# Altium schematic sheet 11-SoC POWER1.SchDoc
size 513 x 386 mm
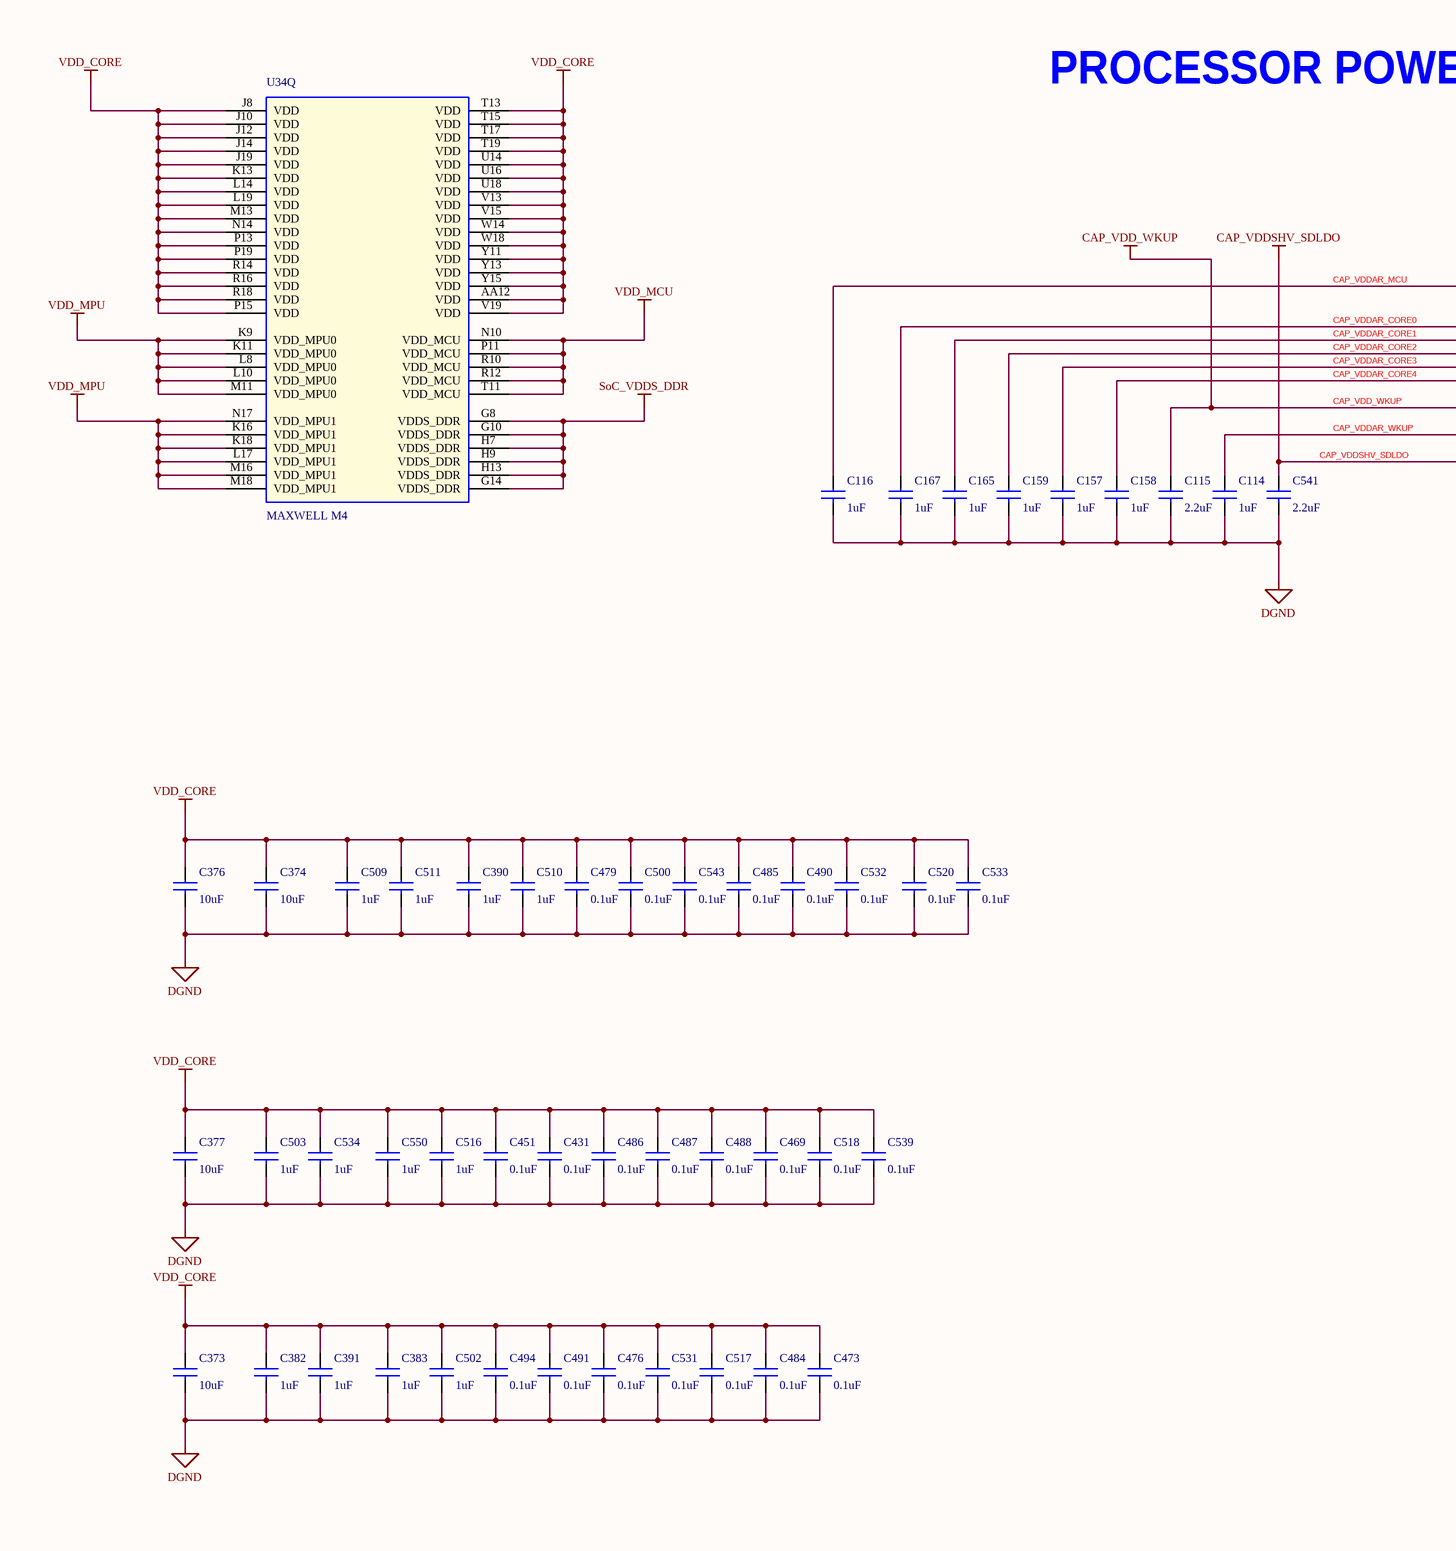
[diagram p0: 11-SoC POWER1.SchDoc, left]
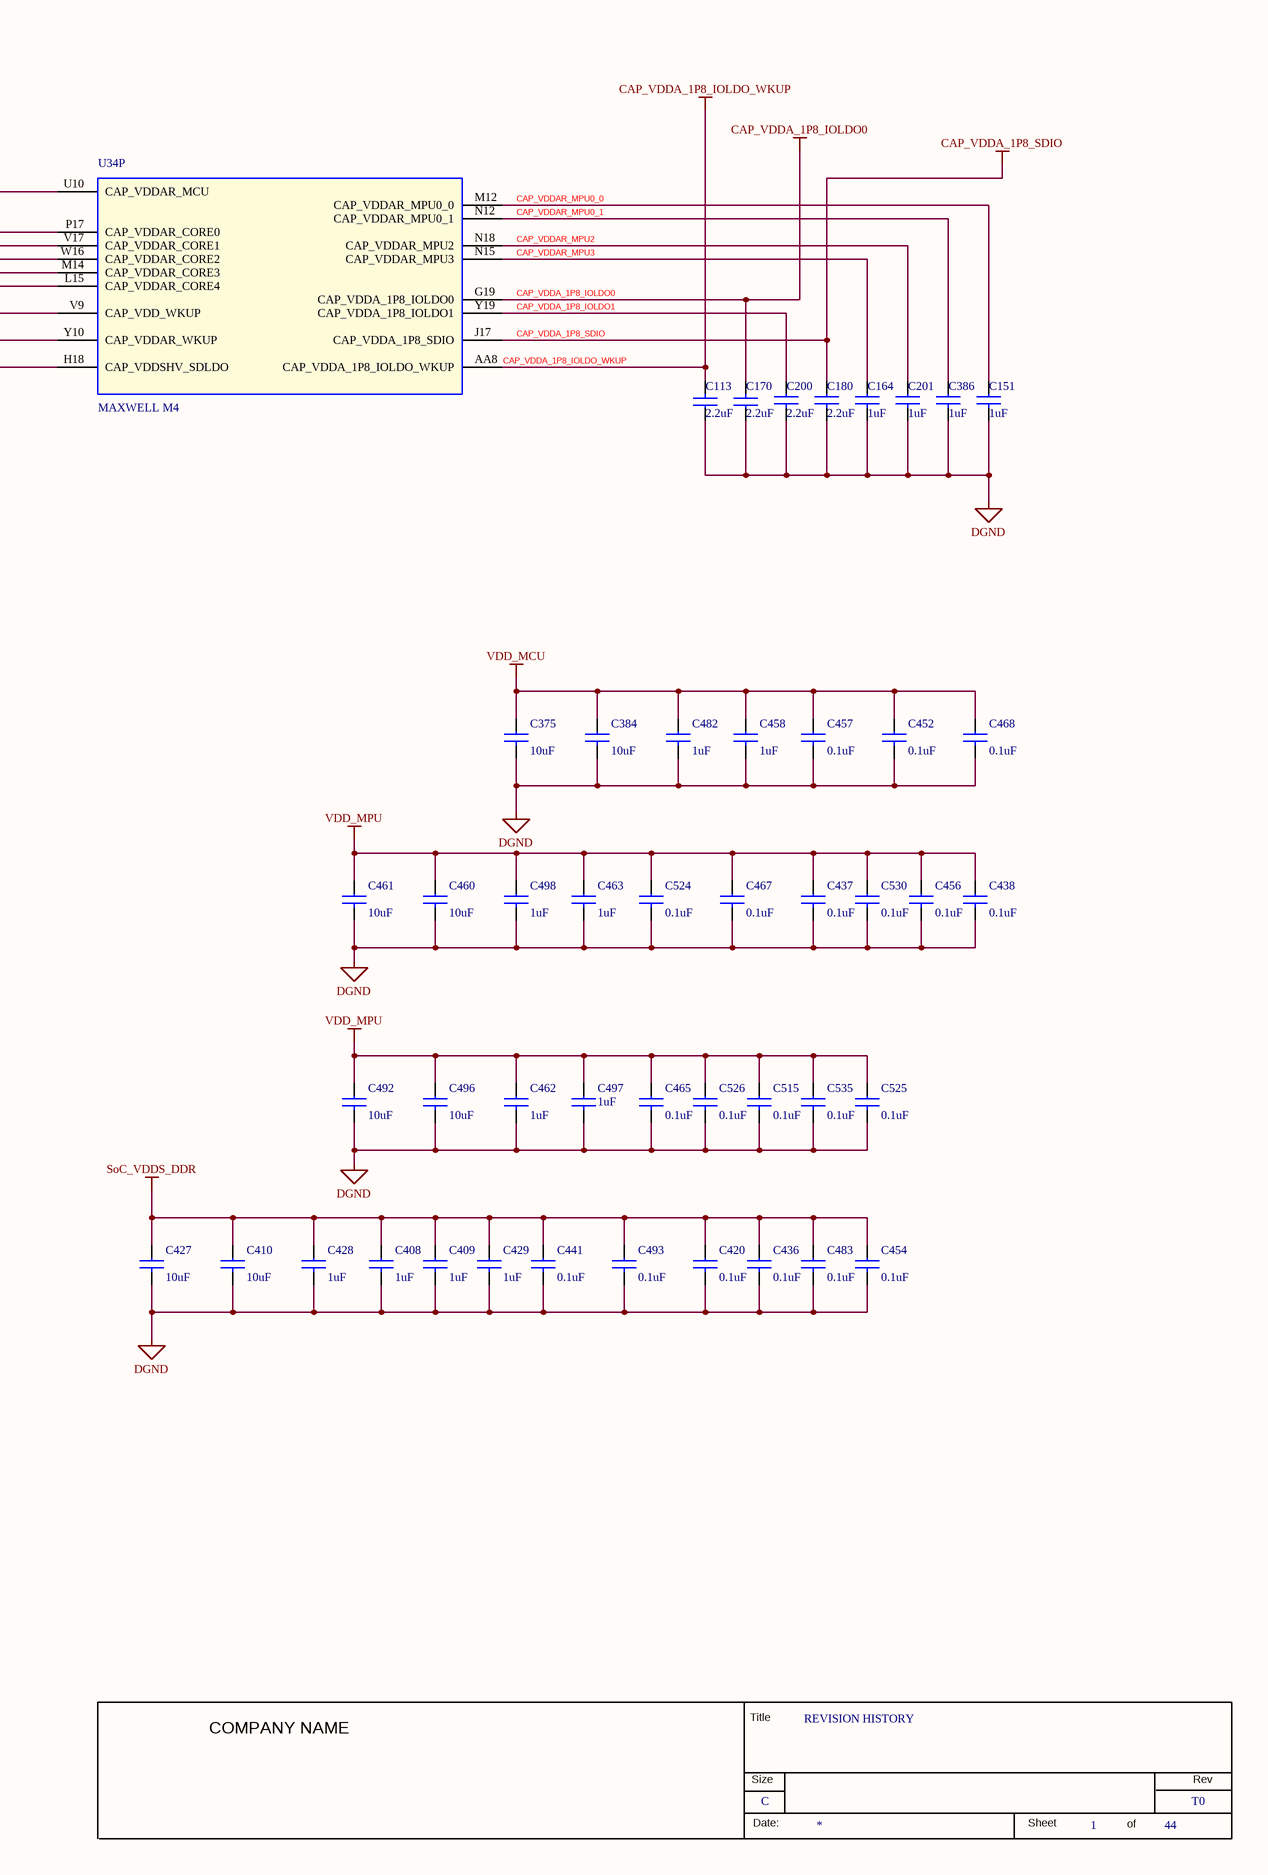
[diagram p1: 11-SoC POWER1.SchDoc, right]

## Parts
*  RevCode: T0  Title: REVISION HISTORY  Page Size: C  Page Number: 1  Page Count: 44  (hidden comment: TRAINING_TITLEBLK_CSIZE)  (graphical)
C113  2.2uF  [CAP0603]
C114  1uF  [CAP0402_0-75]
C115  2.2uF  [CAP0402_0-75]
C116  1uF  [CAP0402_0-75]
C151  1uF  [CAP0402_0-75]
C157  1uF  [CAP0402_0-75]
C158  1uF  [CAP0402_0-75]
C159  1uF  [CAP0402_0-75]
C164  1uF  [CAP0402_0-75]
C165  1uF  [CAP0402_0-75]
C167  1uF  [CAP0402_0-75]
C170  2.2uF  [CAP0603]
C180  2.2uF  [CAP0402_0-75]
C200  2.2uF  [CAP0402_0-75]
C201  1uF  [CAP0402_0-75]
C373  10uF  [CAP0603_1]
C374  10uF  [CAP0603_1]
C375  10uF  [CAP0603_1]
C376  10uF  [CAP0603_1]
C377  10uF  [CAP0603_1]
C382  1uF  [CAP0402_0-75]
C383  1uF  [CAP0402_0-75]
C384  10uF  [CAP0603_1]
C386  1uF  [CAP0402_0-75]
C390  1uF  [CAP0402_0-75]
C391  1uF  [CAP0402_0-75]
C408  1uF  [CAP0402_0-75]
C409  1uF  [CAP0402_0-75]
C410  10uF  [CAP0603_1]
C420  0.1uF  [CAP0201_0-5]
C427  10uF  [CAP0603_1]
C428  1uF  [CAP0402_0-75]
C429  1uF  [CAP0402_0-75]
C431  0.1uF  [CAP0201_0-5]
C436  0.1uF  [CAP0201_0-5]
C437  0.1uF  [CAP0201_0-5]
C438  0.1uF  [CAP0201_0-5]
C441  0.1uF  [CAP0201_0-5]
C451  0.1uF  [CAP0201_0-5]
C452  0.1uF  [CAP0201_0-5]
C454  0.1uF  [CAP0201_0-5]
C456  0.1uF  [CAP0201_0-5]
C457  0.1uF  [CAP0201_0-5]
C458  1uF  [CAP0402_0-75]
C460  10uF  [CAP0603_1]
C461  10uF  [CAP0603_1]
C462  1uF  [CAP0402_0-75]
C463  1uF  [CAP0402_0-75]
C465  0.1uF  [CAP0201_0-5]
C467  0.1uF  [CAP0201_0-5]
C468  0.1uF  [CAP0201_0-5]
C469  0.1uF  [CAP0201_0-5]
C473  0.1uF  [CAP0201_0-5]
C476  0.1uF  [CAP0201_0-5]
C479  0.1uF  [CAP0201_0-5]
C482  1uF  [CAP0402_0-75]
C483  0.1uF  [CAP0201_0-5]
C484  0.1uF  [CAP0201_0-5]
C485  0.1uF  [CAP0201_0-5]
C486  0.1uF  [CAP0201_0-5]
C487  0.1uF  [CAP0201_0-5]
C488  0.1uF  [CAP0201_0-5]
C490  0.1uF  [CAP0201_0-5]
C491  0.1uF  [CAP0201_0-5]
C492  10uF  [CAP0603_1]
C493  0.1uF  [CAP0201_0-5]
C494  0.1uF  [CAP0201_0-5]
C496  10uF  [CAP0603_1]
C497  1uF  [CAP0402_0-75]
C498  1uF  [CAP0402_0-75]
C500  0.1uF  [CAP0201_0-5]
C502  1uF  [CAP0402_0-75]
C503  1uF  [CAP0402_0-75]
C509  1uF  [CAP0402_0-75]
C510  1uF  [CAP0402_0-75]
C511  1uF  [CAP0402_0-75]
C515  0.1uF  [CAP0201_0-5]
C516  1uF  [CAP0402_0-75]
C517  0.1uF  [CAP0201_0-5]
C518  0.1uF  [CAP0201_0-5]
C520  0.1uF  [CAP0201_0-5]
C524  0.1uF  [CAP0201_0-5]
C525  0.1uF  [CAP0201_0-5]
C526  0.1uF  [CAP0201_0-5]
C530  0.1uF  [CAP0201_0-5]
C531  0.1uF  [CAP0201_0-5]
C532  0.1uF  [CAP0201_0-5]
C533  0.1uF  [CAP0201_0-5]
C534  1uF  [CAP0402_0-75]
C535  0.1uF  [CAP0201_0-5]
C539  0.1uF  [CAP0201_0-5]
C541  2.2uF  [CAP0402_0-75]
C543  0.1uF  [CAP0201_0-5]
C550  1uF  [CAP0402_0-75]
U34  MAXWELL M4  [BGA784_31-49_910X910_1-7]  (parts P,Q of 19)

## Nets
CAP_VDD_WKUP: C115.1 U34.V9(CAP_VDD_WKUP)
CAP_VDDA_1P8_IOLDO0: C170.2 U34.G19(CAP_VDDA_1P8_IOLDO0)
CAP_VDDA_1P8_IOLDO_WKUP: C113.2 U34.AA8(CAP_VDDA_1P8_IOLDO_WKUP)
CAP_VDDA_1P8_SDIO: C180.1 U34.J17(CAP_VDDA_1P8_SDIO)
CAP_VDDSHV_SDLDO: C541.1 U34.H18(CAP_VDDSHV_SDLDO)
DGND: C113.1 C114.2 C115.2 C116.2 C151.2 C157.2 C158.2 C159.2 C164.2 C165.2 C167.2 C170.1 C180.2 C200.2 C201.2 C373.2 C374.2 C375.2 C376.2 C377.2 C382.2 C383.2 C384.2 C386.2 C390.2 C391.2 C408.2 C409.2 C410.2 C420.2 C427.2 C428.2 C429.2 C431.2 C436.2 C437.2 C438.2 C441.2 C451.2 C452.2 C454.2 C456.2 C457.2 C458.2 C460.2 C461.2 C462.2 C463.2 C465.2 C467.2 C468.2 C469.2 C473.2 C476.2 C479.2 C482.2 C483.2 C484.2 C485.2 C486.2 C487.2 C488.2 C490.2 C491.2 C492.2 C493.2 C494.2 C496.2 C497.2 C498.2 C500.2 C502.2 C503.2 C509.2 C510.2 C511.2 C515.2 C516.2 C517.2 C518.2 C520.2 C524.2 C525.2 C526.2 C530.2 C531.2 C532.2 C533.2 C534.2 C535.2 C539.2 C541.2 C543.2 C550.2
SoC_VDDS_DDR: C408.1 C409.1 C410.1 C420.1 C427.1 C428.1 C429.1 C436.1 C441.1 C454.1 C483.1 C493.1 U34.G8(VDDS_DDR) U34.G10(VDDS_DDR) U34.G14(VDDS_DDR) U34.H7(VDDS_DDR) U34.H9(VDDS_DDR) U34.H13(VDDS_DDR)
VDD_CORE: C373.1 C374.1 C376.1 C377.1 C382.1 C383.1 C390.1 C391.1 C431.1 C451.1 C469.1 C473.1 C476.1 C479.1 C484.1 C485.1 C486.1 C487.1 C488.1 C490.1 C491.1 C494.1 C500.1 C502.1 C503.1 C509.1 C510.1 C511.1 C516.1 C517.1 C518.1 C520.1 C531.1 C532.1 C533.1 C534.1 C539.1 C543.1 C550.1 U34.AA12(VDD) U34.J8(VDD) U34.J10(VDD) U34.J12(VDD) U34.J14(VDD) U34.J19(VDD) U34.K13(VDD) U34.L14(VDD) U34.L19(VDD) U34.M13(VDD) U34.N14(VDD) U34.P13(VDD) U34.P15(VDD) U34.P19(VDD) U34.R14(VDD) U34.R16(VDD) U34.R18(VDD) U34.T13(VDD) U34.T15(VDD) U34.T17(VDD) U34.T19(VDD) U34.U14(VDD) U34.U16(VDD) U34.U18(VDD) U34.V13(VDD) U34.V15(VDD) U34.V19(VDD) U34.W14(VDD) U34.W18(VDD) U34.Y11(VDD) U34.Y13(VDD) U34.Y15(VDD)
VDD_MCU: C375.1 C384.1 C452.1 C457.1 C458.1 C468.1 C482.1 U34.N10(VDD_MCU) U34.P11(VDD_MCU) U34.R10(VDD_MCU) U34.R12(VDD_MCU) U34.T11(VDD_MCU)
VDD_MPU: C437.1 C438.1 C456.1 C460.1 C461.1 C462.1 C463.1 C465.1 C467.1 C492.1 C496.1 C497.1 C498.1 C515.1 C524.1 C525.1 C526.1 C530.1 C535.1 U34.K9(VDD_MPU0) U34.K11(VDD_MPU0) U34.K16(VDD_MPU1) U34.K18(VDD_MPU1) U34.L8(VDD_MPU0) U34.L10(VDD_MPU0) U34.L17(VDD_MPU1) U34.M11(VDD_MPU0) U34.M16(VDD_MPU1) U34.M18(VDD_MPU1) U34.N17(VDD_MPU1)
CAP_VDDA_1P8_IOLDO1: C200.1 U34.Y19(CAP_VDDA_1P8_IOLDO1)
CAP_VDDAR_CORE0: C167.1 U34.P17(CAP_VDDAR_CORE0)
CAP_VDDAR_CORE1: C165.1 U34.V17(CAP_VDDAR_CORE1)
CAP_VDDAR_CORE2: C159.1 U34.W16(CAP_VDDAR_CORE2)
CAP_VDDAR_CORE3: C157.1 U34.M14(CAP_VDDAR_CORE3)
CAP_VDDAR_CORE4: C158.1 U34.L15(CAP_VDDAR_CORE4)
CAP_VDDAR_MCU: C116.1 U34.U10(CAP_VDDAR_MCU)
CAP_VDDAR_MPU0_0: C151.1 U34.M12(CAP_VDDAR_MPU0_0)
CAP_VDDAR_MPU0_1: C386.1 U34.N12(CAP_VDDAR_MPU0_1)
CAP_VDDAR_MPU2: C201.1 U34.N18(CAP_VDDAR_MPU2)
CAP_VDDAR_MPU3: C164.1 U34.N15(CAP_VDDAR_MPU3)
CAP_VDDAR_WKUP: C114.1 U34.Y10(CAP_VDDAR_WKUP)

## Notes on the sheet
- PROCESSOR POWER & DECAPS
- (in symbol TRAINING_TITLEBLK_CSIZE) Title; COMPANY NAME; Size; Rev; Date:; Sheet; of

## Library data of the parts
* = TRAINING_TITLEBLK_CSIZE: Issue: 1.0; Page Create Date: Jan  8, 2022; Page Modify Date: *
C113 C170 = CAP_Dup5: CAP CERAMIC 2.2uF 10V 10% X5R 0603; Mistral Part No: 120009030289-R; Mfr_name: KEMET; Mfr_part_number: C0603C225K8PACTU; Part_type: CAPACITORS\CERAMIC; Alternate_mfr_name_C: PANASONIC-ECG; Alternate_mfr_part_number_C: ECJ-1VB1A225K; Project: PMP LCD BOARD; Customs_HS_Code: 85322990; Custom_Duty: 15%; Library Ref: CAP; Tolerance: 10%; Voltage: 10V; Package: 0603; Distributor_name: MOUSER; Distributor_part_number: 80-C0603C225K8P; Height: 0.90MM; Datasheet: Y:\MIS_DATABASE\DATASHEETS\CAPACITORS\KEMET-C08.PDF; Crtd /date: MAZHAR/291106; Chkd/date: SHREESHAIL/280507; Distributor_name_C: DIGIKEY; Distributor_part_number_C: PCC2397CT-ND; PCB Footprint: CAP0603
C114 C151 C157 C159 C164 C165 C382 C383 C386 C390 C391 C408 C409 C458 C497 C502 C509 C510 C550 = CAP_Dup5: CAP CERAMIC 1uF 16V 20% X5R 0402; Part_type: CAPACITORS\CERAMIC; Mfr_part_number: EMK105BJ105MV-F; Mfr_name: TAIYO YUDEN; Mistral Part No: 120018020006-R; Custom_Duty: 15%; Customs_HS_Code: 85322990; Wattage: NA; Project: TI_MAXIE_CPB; Footprint Ref: CAP0402_0-75; Library Ref: CAP; Chkd/date: MANIRAJA/150218; Crtd /date: ALVY/150218; Datasheet: Y:\MIS_DATABASE\DATASHEETS\CAPACITORS\EMK105BJ105MV-F.PDF; Temperature: -55°C+85°C; Weight: 0.65mg; Height: 0.55MM; Distributor_part_number: 587-5514-1-ND; Distributor_name: DIGIKEY; Package: 0402; Voltage: 16V; Tolerance: 20%; PCB Footprint: CAP0402_0-75; MECHANICAL 3D STEP FILE: CAP0402_0-75; Library Path: Y:\MIS_DATABASE\Library\ALTIUM_TOOL\SCHEMATICS_PARTS\MS_DISCRETE_Library.schlib; Footprint Path: Y:\MIS_DATABASE\Library\ALTIUM_TOOL\PCB_FOOTPRINTS\Altium_Footprint_Lib.PcbLib
C115 C180 C200 C541 = CAP_Dup5: CAP CERAMIC 2.2uF 10V 20% X5R 0402; Mistral Part No: 120018010016-R; Mfr_name: MURATA; Mfr_part_number: GRT155R61A225ME01D; Part_type: CAPACITORS\CERAMIC; Project: TI_MAXIE_CPB; Wattage: NA; Customs_HS_Code: 85322990; Custom_Duty: 15%; Library Ref: CAP; Tolerance: 20%; Voltage: 10V; Package: 0402; Distributor_name: DIGIKEY; Distributor_part_number: 490-12254-1-ND; Height: 0.55MM; Weight: 0.65mg; Temperature: -55°C+85°C; Datasheet: Y:\MIS_DATABASE\DATASHEETS\CAPACITORS\GRT155R61A225ME01.PDF; Crtd /date: MANIRAJA/240118; Chkd/date: MANIRAJA/240118; PCB Footprint: CAP0402_0-75; MECHANICAL 3D STEP FILE: CAP0402_0-75
C116 C158 C167 C201 C428 C429 C462 C463 C482 C498 C503 C511 C516 C534 = CAP_Dup5: CAP CERAMIC 1uF 16V 20% X5R 0402; Mistral Part No: 120018020006-R; Mfr_name: TAIYO YUDEN; Mfr_part_number: EMK105BJ105MV-F; Part_type: CAPACITORS\CERAMIC; Project: TI_MAXIE_CPB; Wattage: NA; Customs_HS_Code: 85322990; Custom_Duty: 15%; Footprint Ref: CAP0402_0-75; Library Ref: CAP; Tolerance: 20%; Voltage: 16V; Package: 0402; Distributor_name: DIGIKEY; Distributor_part_number: 587-5514-1-ND; Height: 0.55MM; Weight: 0.65mg; Temperature: -55°C+85°C; Datasheet: Y:\MIS_DATABASE\DATASHEETS\CAPACITORS\EMK105BJ105MV-F.PDF; Crtd /date: ALVY/150218; Chkd/date: MANIRAJA/150218; PCB Footprint: CAP0402_0-75; MECHANICAL 3D STEP FILE: CAP0402_0-75; Library Path: Y:\MIS_DATABASE\Library\ALTIUM_TOOL\SCHEMATICS_PARTS\MS_DISCRETE_Library.schlib; Footprint Path: Y:\MIS_DATABASE\Library\ALTIUM_TOOL\PCB_FOOTPRINTS\Altium_Footprint_Lib.PcbLib
C373 C374 C376 C460 C461 C492 C496 = CAP_Dup5: CAP CERAMIC 10uF 10V 10% X5R 0603; Part_type: CAPACITORS\CERAMIC; Mfr_part_number: 0603ZD106KAT2A; Mfr_name: AVX CORPORATION; Mistral Part No: 120010080001-R; Wattage: NA; Custom_Duty: 15%; Customs_HS_Code: 85322990; Project: TI_MAXIE_CPB; MECHANICAL 3D STEP FILE: CAP0603_1; Temperature: -55°C+85°C; Weight: 2mg; Chkd/date: MANIRAJA/230118; Crtd /date: MANIRAJA/230118; Datasheet: Y:\MIS_DATABASE\DATASHEETS\CAPACITORS\AVX_MLC.PDF; Height: 0.94MM; Distributor_part_number: 478-10766-1-ND; Distributor_name: DIGIKEY; Package: 0603; Voltage: 10V; Tolerance: 10%; Library Ref: CAP; PCB Footprint: CAP0603_1
C375 C377 C384 C410 C427 = CAP_Dup5: CAP CERAMIC 10uF 10V 10% X5R 0603; Mistral Part No: 120010080001-R; Mfr_name: AVX CORPORATION; Mfr_part_number: 0603ZD106KAT2A; Part_type: CAPACITORS\CERAMIC; Wattage: NA; Project: TI_MAXIE_CPB; Customs_HS_Code: 85322990; Custom_Duty: 15%; MECHANICAL 3D STEP FILE: CAP0603_1; Temperature: -55°C+85°C; Weight: 2mg; Tolerance: 10%; Voltage: 10V; Package: 0603; Distributor_name: DIGIKEY; Distributor_part_number: 478-10766-1-ND; Height: 0.94MM; Datasheet: Y:\MIS_DATABASE\DATASHEETS\CAPACITORS\AVX_MLC.PDF; Crtd /date: MANIRAJA/230118; Chkd/date: MANIRAJA/230118; Library Ref: CAP; PCB Footprint: CAP0603_1
C420 C437 C441 C452 C454 C456 C465 C473 C486-C488 C490 C494 C517 C518 C520 C524 C526 C535 C543 = CAP_Dup5: CAP CERAMIC 0.1uF 16V 10% X5R 0201; Mistral Part No: 120009030072-R; Mfr_name: MURATA; Mfr_part_number: GRM033R61C104KE84J; Part_type: CAPACITORS\CERAMIC; Project: TI_MAXIE_CPB; Wattage: NA; Customs_HS_Code: 85322990; Custom_Duty: 15%; Library Ref: CAP; PCB Footprint: CAP0201_0-5; Tolerance: 10%; Voltage: 16V; Package: 0201; Distributor_name: DIGIKEY; Distributor_part_number: 490-16742-1-ND; Height: 0.33MM; Weight: 0.33mg; Temperature: -55°C+85°C; Datasheet: Y:\MIS_DATABASE\DATASHEETS\CAPACITORS\GRM033R61C104KE84.PDF; Crtd /date: MANIRAJA/120218; Chkd/date: MANIRAJA/120218; MECHANICAL 3D STEP FILE: CAP0201_0-5
C431 C436 C438 C451 C457 C467-C469 C476 C479 C483-C485 C491 C493 C500 C515 C525 C530-C533 C539 = CAP_Dup5: CAP CERAMIC 0.1uF 16V 10% X5R 0201; Part_type: CAPACITORS\CERAMIC; Mfr_part_number: GRM033R61C104KE84J; Mfr_name: MURATA; Mistral Part No: 120009030072-R; Custom_Duty: 15%; Customs_HS_Code: 85322990; Wattage: NA; Project: TI_MAXIE_CPB; Library Ref: CAP; PCB Footprint: CAP0201_0-5; MECHANICAL 3D STEP FILE: CAP0201_0-5; Chkd/date: MANIRAJA/120218; Crtd /date: MANIRAJA/120218; Datasheet: Y:\MIS_DATABASE\DATASHEETS\CAPACITORS\GRM033R61C104KE84.PDF; Temperature: -55°C+85°C; Weight: 0.33mg; Height: 0.33MM; Distributor_part_number: 490-16742-1-ND; Distributor_name: DIGIKEY; Package: 0201; Voltage: 16V; Tolerance: 10%
U34 = AM654X_BGA784: IC MAXWELL MICRO CONTROLLER UNIT BGA784; Mistral Part No: 141217100003; Mfr_name: TEXAS INSTRUMENTS; Mfr_part_number: MAXWELL M4_EVM; Part_type: ICS\DIGITAL\MICROCONTROLLER; Project: TI_MAXIE_CPB; Tolerance: NA; Customs_HS_Code: 85423100; Custom_Duty: 15%; Library Ref: AM654X_BGA784; Voltage: NA; Wattage: NA; Package: BGA784; Distributor_name: NA; Distributor_part_number: NA; Height: 1.63MM; Weight: NA; Temperature: NA; Datasheet: Y:\MIS_DATABASE\DATASHEETS\ICS\DIGITAL\MICROCONTROLLER\MAXWELLM4.PDF; Crtd /date: MANIRAJA/130717; Chkd/date: MANIRAJA/130717; MECHANICAL 3D STEP FILE: BGA784_31-49_910X910_1-7; PCB Footprint: BGA784_31-49_910X910_1-7